# EAGLE design EndNode (EAGLE 6.2)
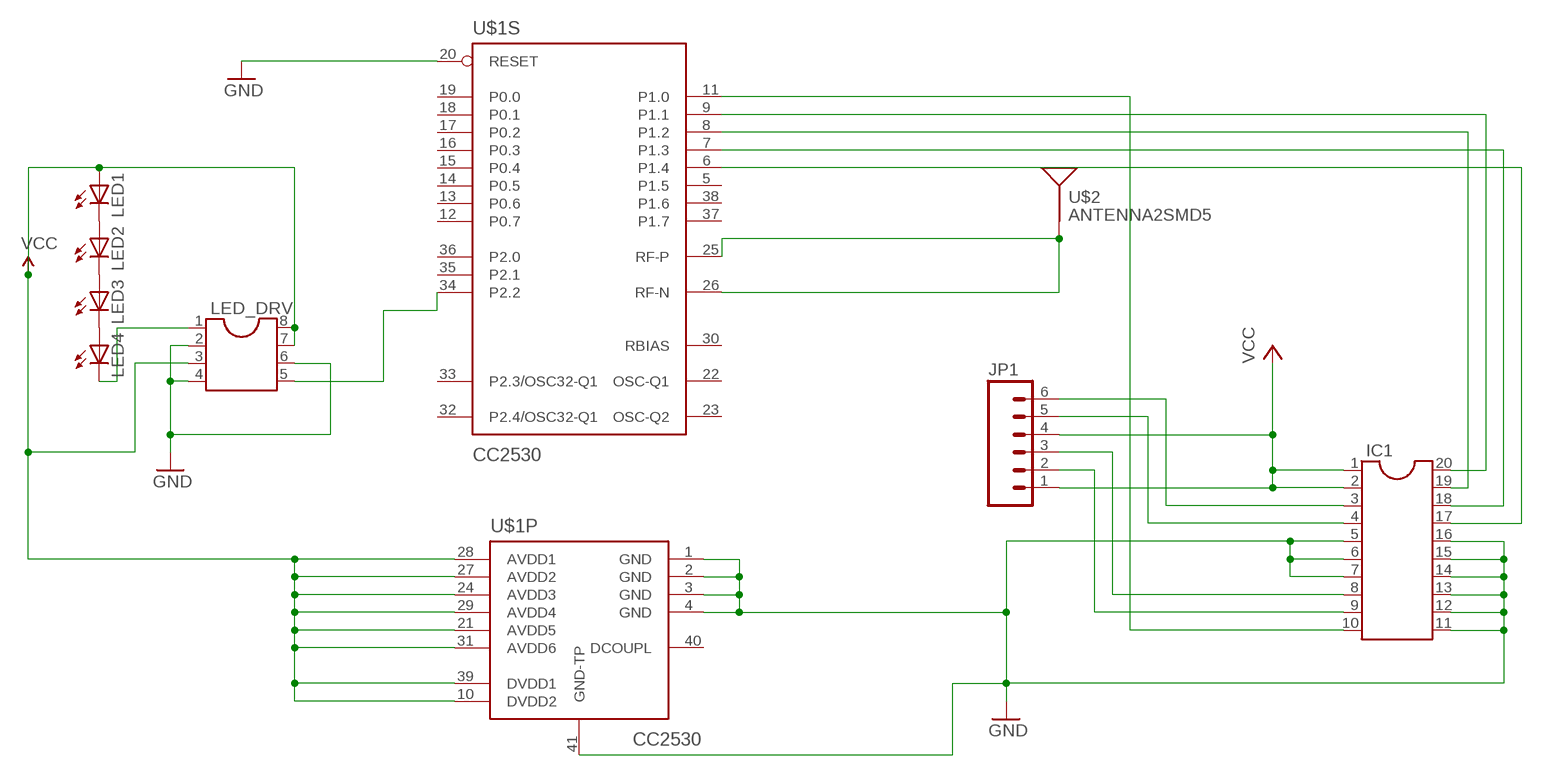
[diagram p0: schematic, sheet 1]

## Parts
IC1  DIL20  [DIL20]
JP1  M06POLAR  [MOLEX-1X6]
LED1  LED5MM  [LED5MM]
LED2  LED5MM  [LED5MM]
LED3  LED5MM  [LED5MM]
LED4  LED5MM  [LED5MM]
LED_DRV  DIL8  [DIL08]
U$1  CC2530  [QFN50P600X600X100-41N]
U$2  ANTENNA2SMD5  [ANTENNA-CHIP5]

## Nets
GND: IC1.5 IC1.6 IC1.7 IC1.11 IC1.12 IC1.13 IC1.14 IC1.15 IC1.16 LED_DRV.2 LED_DRV.4 LED_DRV.6 U$1.1(GND) U$1.2(GND) U$1.3(GND) U$1.4(GND) U$1.20(RESET) U$1.41(GND-TP)
N$1: LED1.K(C) LED2.A
N$2: LED2.K(C) LED3.A
N$3: LED3.K(C) LED4.A
N$4: LED4.K(C) LED_DRV.1
N$5: IC1.3 JP1.6
N$6: IC1.10 U$1.11(P1.0)
N$7: LED_DRV.5 U$1.34(P2.2)
N$8: IC1.20 U$1.9(P1.1)
N$9: IC1.19 U$1.8(P1.2)
N$10: IC1.18 U$1.7(P1.3)
N$11: IC1.17 U$1.6(P1.4)
N$12: IC1.4 JP1.5
N$13: IC1.8 JP1.3
N$14: IC1.9 JP1.2
U$2: U$1.25(RF-P) U$1.26(RF-N) U$2.FEED(SIGNAL)
VCC: LED1.A LED_DRV.3 LED_DRV.7 LED_DRV.8 U$1.10(DVDD2) U$1.21(AVDD5) U$1.24(AVDD3) U$1.27(AVDD2) U$1.28(AVDD1) U$1.29(AVDD4) U$1.31(AVDD6) U$1.39(DVDD1)
VM: IC1.1 IC1.2 JP1.1 JP1.4 ; supply symbol labelled VCC
Unconnected: U$1.5(P1.5) U$1.12(P0.7) U$1.13(P0.6) U$1.14(P0.5) U$1.15(P0.4) U$1.16(P0.3) U$1.17(P0.2) U$1.18(P0.1) U$1.19(P0.0) U$1.22(OSC-Q1) U$1.23(OSC-Q2) U$1.30(RBIAS) U$1.32(P2.4/OSC32-Q1) U$1.33(P2.3/OSC32-Q1) U$1.35(P2.1) U$1.36(P2.0) U$1.37(P1.7) U$1.38(P1.6)

## Power pins joined to a net without a drawn wire
DCOUPL: U$1.40(DCOUPL)

## Library data of the parts
IC1 = ic-package:DIL20: Dual In Line / Socket
JP1 = SparkFun:M06: Header 6 Standard 6-pin 0.1" header. Use with straight break away headers (SKU : PRT-00116), right angle break away headers (PRT-00553), swiss pins (PRT-00743), machine pins (PRT-00117), and female headers (PRT-00115). Molex polarized connector foot print use with SKU : PRT-08094 with associated crimp pins and housings. NOTES ON THE VARIANTS LOCK and LOCK_LONGPADS... This footprint was designed to help hold the alignment of a through-hole component (i.e. 6-pin header) while soldering it into place. You may notice that each hole has been shifted either up or down by 0.005 of an inch from it's more standard position (which is a perfectly straight line). This slight alteration caused the pins (the squares in the middle) to touch the edges of the holes. Because they are alternating, it causes a "brace" to hold the component in place. 0.005 has proven to be the perfect amount of "off-center" position when using our standard breakaway headers. Although looks a little odd when you look at the bare footprint, once you have a header in there, the alteration is very hard to notice. Also, if you push a header all the way into place, it is covered up entirely on the bottom side. This idea of altering the position of holes to aid alignment will be further integrated into the Sparkfun Library for other footprints. It can help hold any component with 3 or more connection pins.
LED1-LED4 = adafruit:LED: LED OSRAM: - CHIPLED LG R971, LG N971, LY N971, LG Q971, LY Q971, LO R971, LY R971 LH N974, LH R974 LS Q976, LO Q976, LY Q976 LO Q996 - Hyper CHIPLED LW Q18S LB Q993, LB Q99A, LB R99A - SideLED LS A670, LO A670, LY A670, LG A670, LP A670 LB A673, LV A673, LT A673, LW A673 LH A674 LY A675 LS A676, LA A676, LO A676, LY A676, LW A676 LS A679, LY A679, LG A679 - Hyper Micro SIDELED® LS Y876, LA Y876, LO Y876, LY Y876 LT Y87S - SmartLED LW L88C, LW L88S LB L89C, LB L89S, LG L890 LS L89K, LO L89K, LY L89K LS L896, LA L896, LO L896, LY L896 - TOPLED LS T670, LO T670, LY T670, LG T670, LP T670 LSG T670, LSP T670, LSY T670, LOP T670, LYG T670 LG T671, LOG T671, LSG T671 LB T673, LV T673, LT T673, LW T673 LH T674 LS T676, LA T676, LO T676, LY T676, LB T676, LH T676, LSB T676, LW T676 LB T67C, LV T67C, LT T67C, LS T67K, LO T67K, LY T67K, LW E67C LS E67B, LA E67B, LO E67B, LY E67B, LB E67C, LV E67C, LT E67C LW T67C LS T679, LY T679, LG T679 LS T770, LO T770, LY T770, LG T770, LP T770 LB T773, LV T773, LT T773, LW T773 LH T774 LS E675, LA E675, LY E675, LS T675 LS T776, LA T776, LO T776, LY T776, LB T776 LHGB T686 LT T68C, LB T68C - Hyper Mini TOPLED® LB M676 - Mini TOPLED Santana® LG M470 LS M47K, LO M47K, LY M47K Source: http://www.osram.convergy.de/
LED_DRV = ic-package:DIL8: Dual In Line / Socket
U$1 = chipcon-ti-v2:CC2530: A True System-on-Chip Solution for 2.4-GHz IEEE 802.15.4 and ZigBee Applications
U$2 = SparkFun-RF:ANTENNA2: Chip antenna Single endded antenna. Common with smaller chip antennas. CHIP4 package is the GPS Chip Antenna SKU: GPS-08418. CHIP5 package is 2.4GHz chip antenna SKU: WRL-00144.

## Board
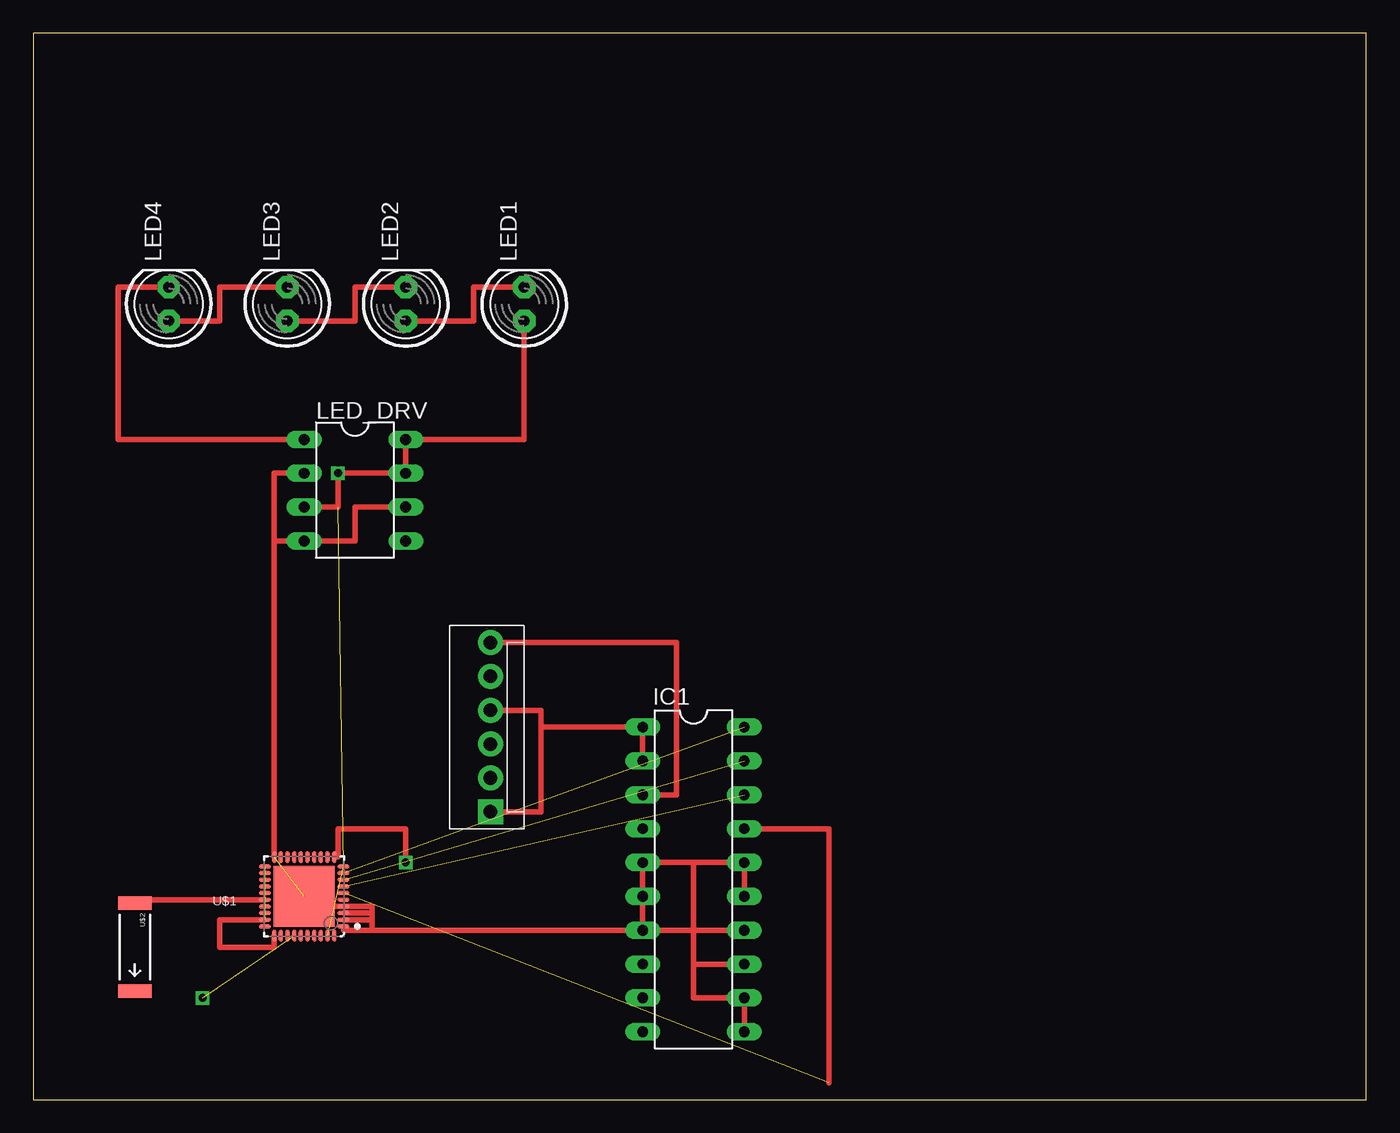
[diagram p1: board, top side]
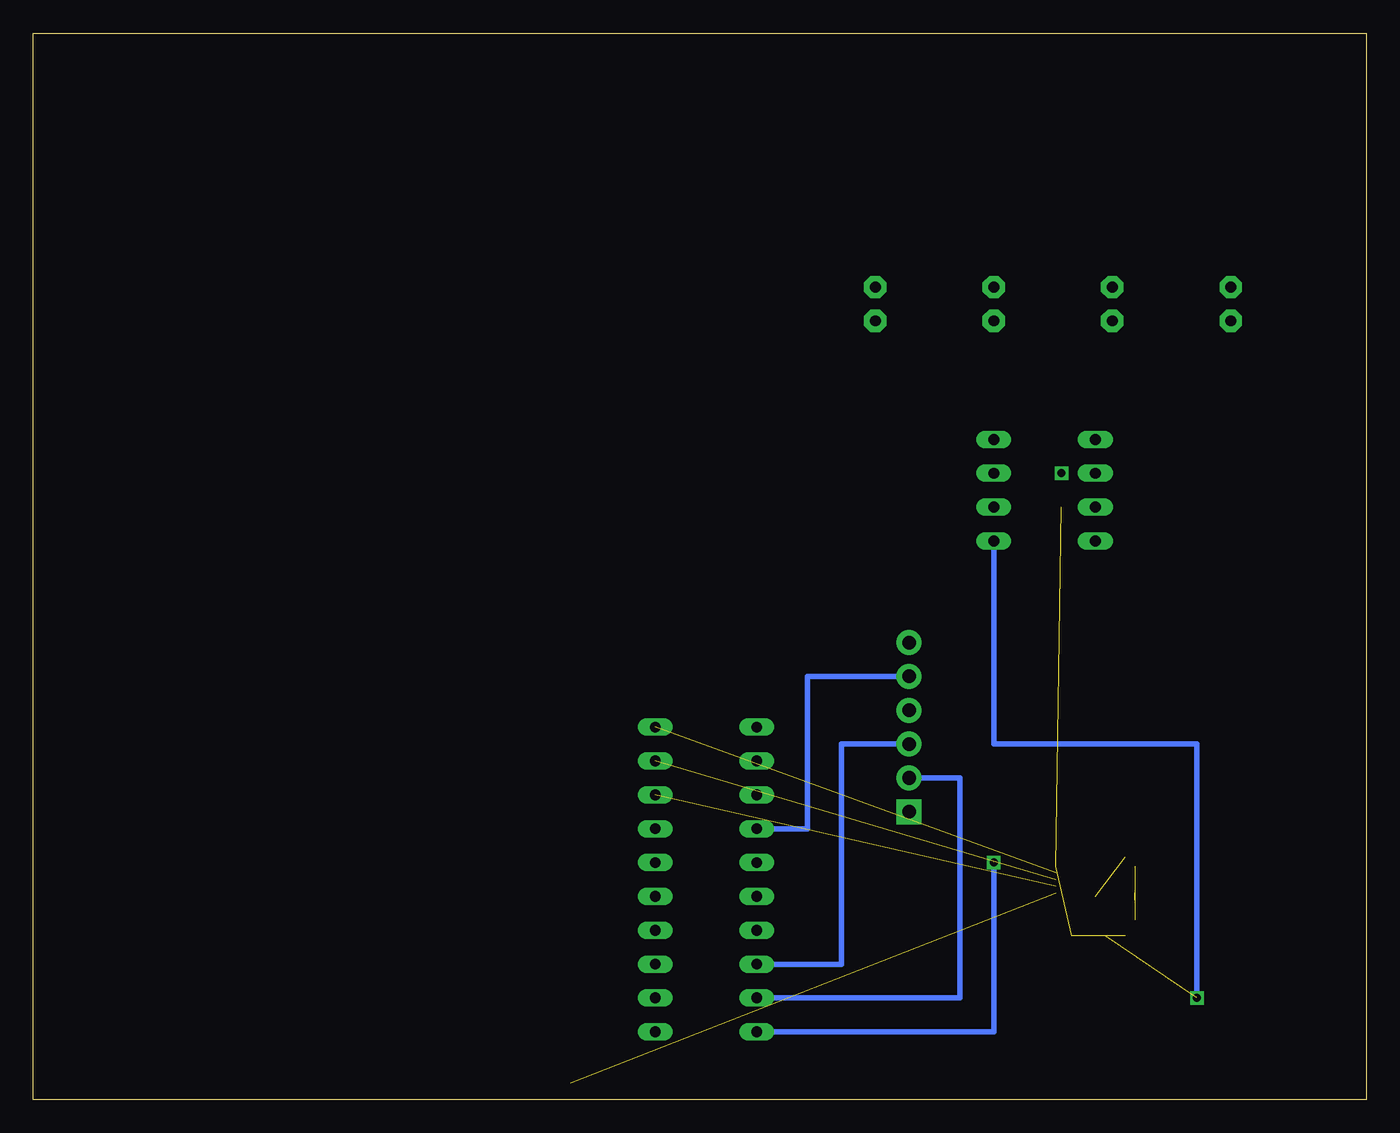
[diagram p2: board, bottom side, seen from below]

Size 100 x 80 mm. Coordinates in mm from the lower left corner, seen from the top.
Outline: 0,0 100,0 100,80 0,80 0,0
Copper layers (1*16): Top 0.035mm / dielectric 1.5mm / Bottom 0.035mm
Design rules: minimum track width 10mil, minimum drill 24mil, track to track 8mil, track to pad 8mil, pad to pad 8mil, via to via 8mil, smd to smd 8mil, copper to edge 40mil, drill to drill 8mil, minimum pad ring 10mil, minimum via ring 8mil, stop-mask expansion 4mil, vias tented up to drill 0mil, thermal gap 10mil

### Footprints (pad centres in the part's own frame; a part is rotated, then mirrored left to right if it is on the bottom)
DIL20 = drill 0.813 long: 1 -11.43,-3.81; 2 -8.89,-3.81; 3 -6.35,-3.81; 4 -3.81,-3.81; 5 -1.27,-3.81; 6 1.27,-3.81; 7 3.81,-3.81; 8 6.35,-3.81; 9 8.89,-3.81; 10 11.43,-3.81; 11 11.43,3.81; 12 8.89,3.81; 13 6.35,3.81; 14 3.81,3.81; 15 1.27,3.81; 16 -1.27,3.81; 17 -3.81,3.81; 18 -6.35,3.81; 19 -8.89,3.81; 20 -11.43,3.81
MOLEX-1X6 = drill 1.016 pad 1.88 square: 1 0,0 | drill 1.016 pad 1.88: 2 2.54,0; 3 5.08,0; 4 7.62,0; 5 10.16,0; 6 12.7,0
LED5MM = drill 0.813 pad 1.676 octagon: A -1.27,0; K 1.27,0
DIL08 = drill 0.813 long: 1 -3.81,-3.81; 2 -1.27,-3.81; 3 1.27,-3.81; 4 3.81,-3.81; 5 3.81,3.81; 6 1.27,3.81; 7 -1.27,3.81; 8 -3.81,3.81
QFN50P600X600X100-41N = smd 0.9 x 0.3: 1 -2.95,2.25; 2 -2.95,1.75; 3 -2.95,1.25; 4 -2.95,0.75; 5 -2.95,0.25; 6 -2.95,-0.25; 7 -2.95,-0.75; 8 -2.95,-1.25; 9 -2.95,-1.75; 10 -2.95,-2.25; 21 2.95,-2.25; 22 2.95,-1.75; 23 2.95,-1.25; 24 2.95,-0.75; 25 2.95,-0.25; 26 2.95,0.25; 27 2.95,0.75; 28 2.95,1.25; 29 2.95,1.75; 30 2.95,2.25 | smd 0.3 x 0.9: 11 -2.25,-2.95; 12 -1.75,-2.95; 13 -1.25,-2.95; 14 -0.75,-2.95; 15 -0.25,-2.95; 16 0.25,-2.95; 17 0.75,-2.95; 18 1.25,-2.95; 19 1.75,-2.95; 20 2.25,-2.95; 31 2.25,2.95; 32 1.75,2.95; 33 1.25,2.95; 34 0.75,2.95; 35 0.25,2.95; 36 -0.25,2.95; 37 -0.75,2.95; 38 -1.25,2.95; 39 -1.75,2.95; 40 -2.25,2.95 | smd 4.6 x 4.6: 41 0,0
ANTENNA-CHIP5 = smd 1.016 x 2.54: FEED -3.302,0; NC 3.302,0

### Placement (x,y rotation side)
IC1  49.53,16.51 270 top
JP1  34.29,21.59 90 top
LED1  36.83,59.69 90 top
LED2  27.94,59.69 90 top
LED3  19.05,59.69 90 top
LED4  10.16,59.69 90 top
LED_DRV  24.13,45.72 270 top
U$1  20.32,15.24 180 top
U$2  7.62,11.43 270 top

### Tracks (layer width: path | path; a pad name or v marks a point on that pad's centre or on a via)
GND  (1 unrouted)
  Top 0.406: LED_DRV.6 24.13,44.45 24.13,41.91 LED_DRV.4 18.07,41.91 | IC1.7 49.53,12.7 | 49.53,12.7 IC1.14 | 49.53,17.78 IC1.5 IC1.6 IC1.7 | 49.53,17.78 49.53,12.7 | 49.53,17.78 IC1.16 IC1.15 | IC1.11 IC1.12 49.53,7.62 49.53,10.16 | 49.53,10.16 49.53,12.7 | IC1.13 49.53,10.16 | IC1.7 25.4,12.7 | 25.4,12.7 23.27,12.7 U$1.1 | U$1.2 25.4,13.49 | 25.4,13.49 25.4,12.7 | 25.4,13.99 25.4,14.49 U$1.4 20.32,14.49 U$1.41 | 25.4,13.99 25.4,13.49 | U$1.3 25.4,13.99 | 18.07,41.91 U$1.20 | LED_DRV.2 18.07,46.99 18.07,41.91
N$1
  Top 0.406: LED1.K 33.02,60.96 33.02,58.42 LED2.A
N$2
  Top 0.406: LED2.K 24.13,60.96 24.13,58.42 LED3.A
N$3
  Top 0.406: LED3.K 13.97,60.96 13.97,58.42 LED4.A
N$4
  Top 0.406: LED4.K 6.35,60.96 6.35,49.53 LED_DRV.1
N$5
  Top 0.406: IC1.3 48.26,22.86 48.26,34.29 JP1.6
N$6  (1 unrouted)
  Top 0.406: U$1.11 22.86,18.19 22.86,20.32 27.94,20.32 27.94,17.78
  Bottom 0.406: IC1.10 27.94,5.08 27.94,17.78
N$7  (1 unrouted)
  Bottom 0.406: LED_DRV.5 27.94,26.67 12.7,26.67 12.7,7.62
N$8  (1 unrouted)
N$9  (1 unrouted)
N$10  (1 unrouted)
N$11  (1 unrouted)
  Top 0.406: IC1.17 59.69,20.32 59.69,1.27
N$12
  Bottom 0.406: JP1.5 41.91,31.75 41.91,20.32 IC1.4
N$13
  Bottom 0.406: JP1.3 39.37,26.67 39.37,10.16 IC1.8
N$14
  Bottom 0.406: JP1.2 30.48,24.13 30.48,7.62 IC1.9
N$15  (via drill 0.6)
  other vias: 27.94,17.78
N$16  (via drill 0.6)
  other vias: 12.7,7.62
U$2  (1 unrouted)
  Top 0.406: U$1.26 7.62,14.99 U$2.FEED
VCC  (via drill 0.6)  (7 unrouted)
  Top 0.406: LED1.A 36.83,49.53 LED_DRV.8 LED_DRV.7 v22.86,46.99 22.86,44.45 LED_DRV.3 | U$1.29 13.97,13.49 13.97,11.43 18.07,11.43 U$1.31
VM
  Top 0.406: 38.1,27.94 IC1.1 IC1.2 | 38.1,27.94 38.1,29.21 JP1.4 | JP1.1 38.1,21.59 38.1,27.94